# EasyEDA Pro project ProDoc_1.智能温室大棚.epro

# Board PCB1
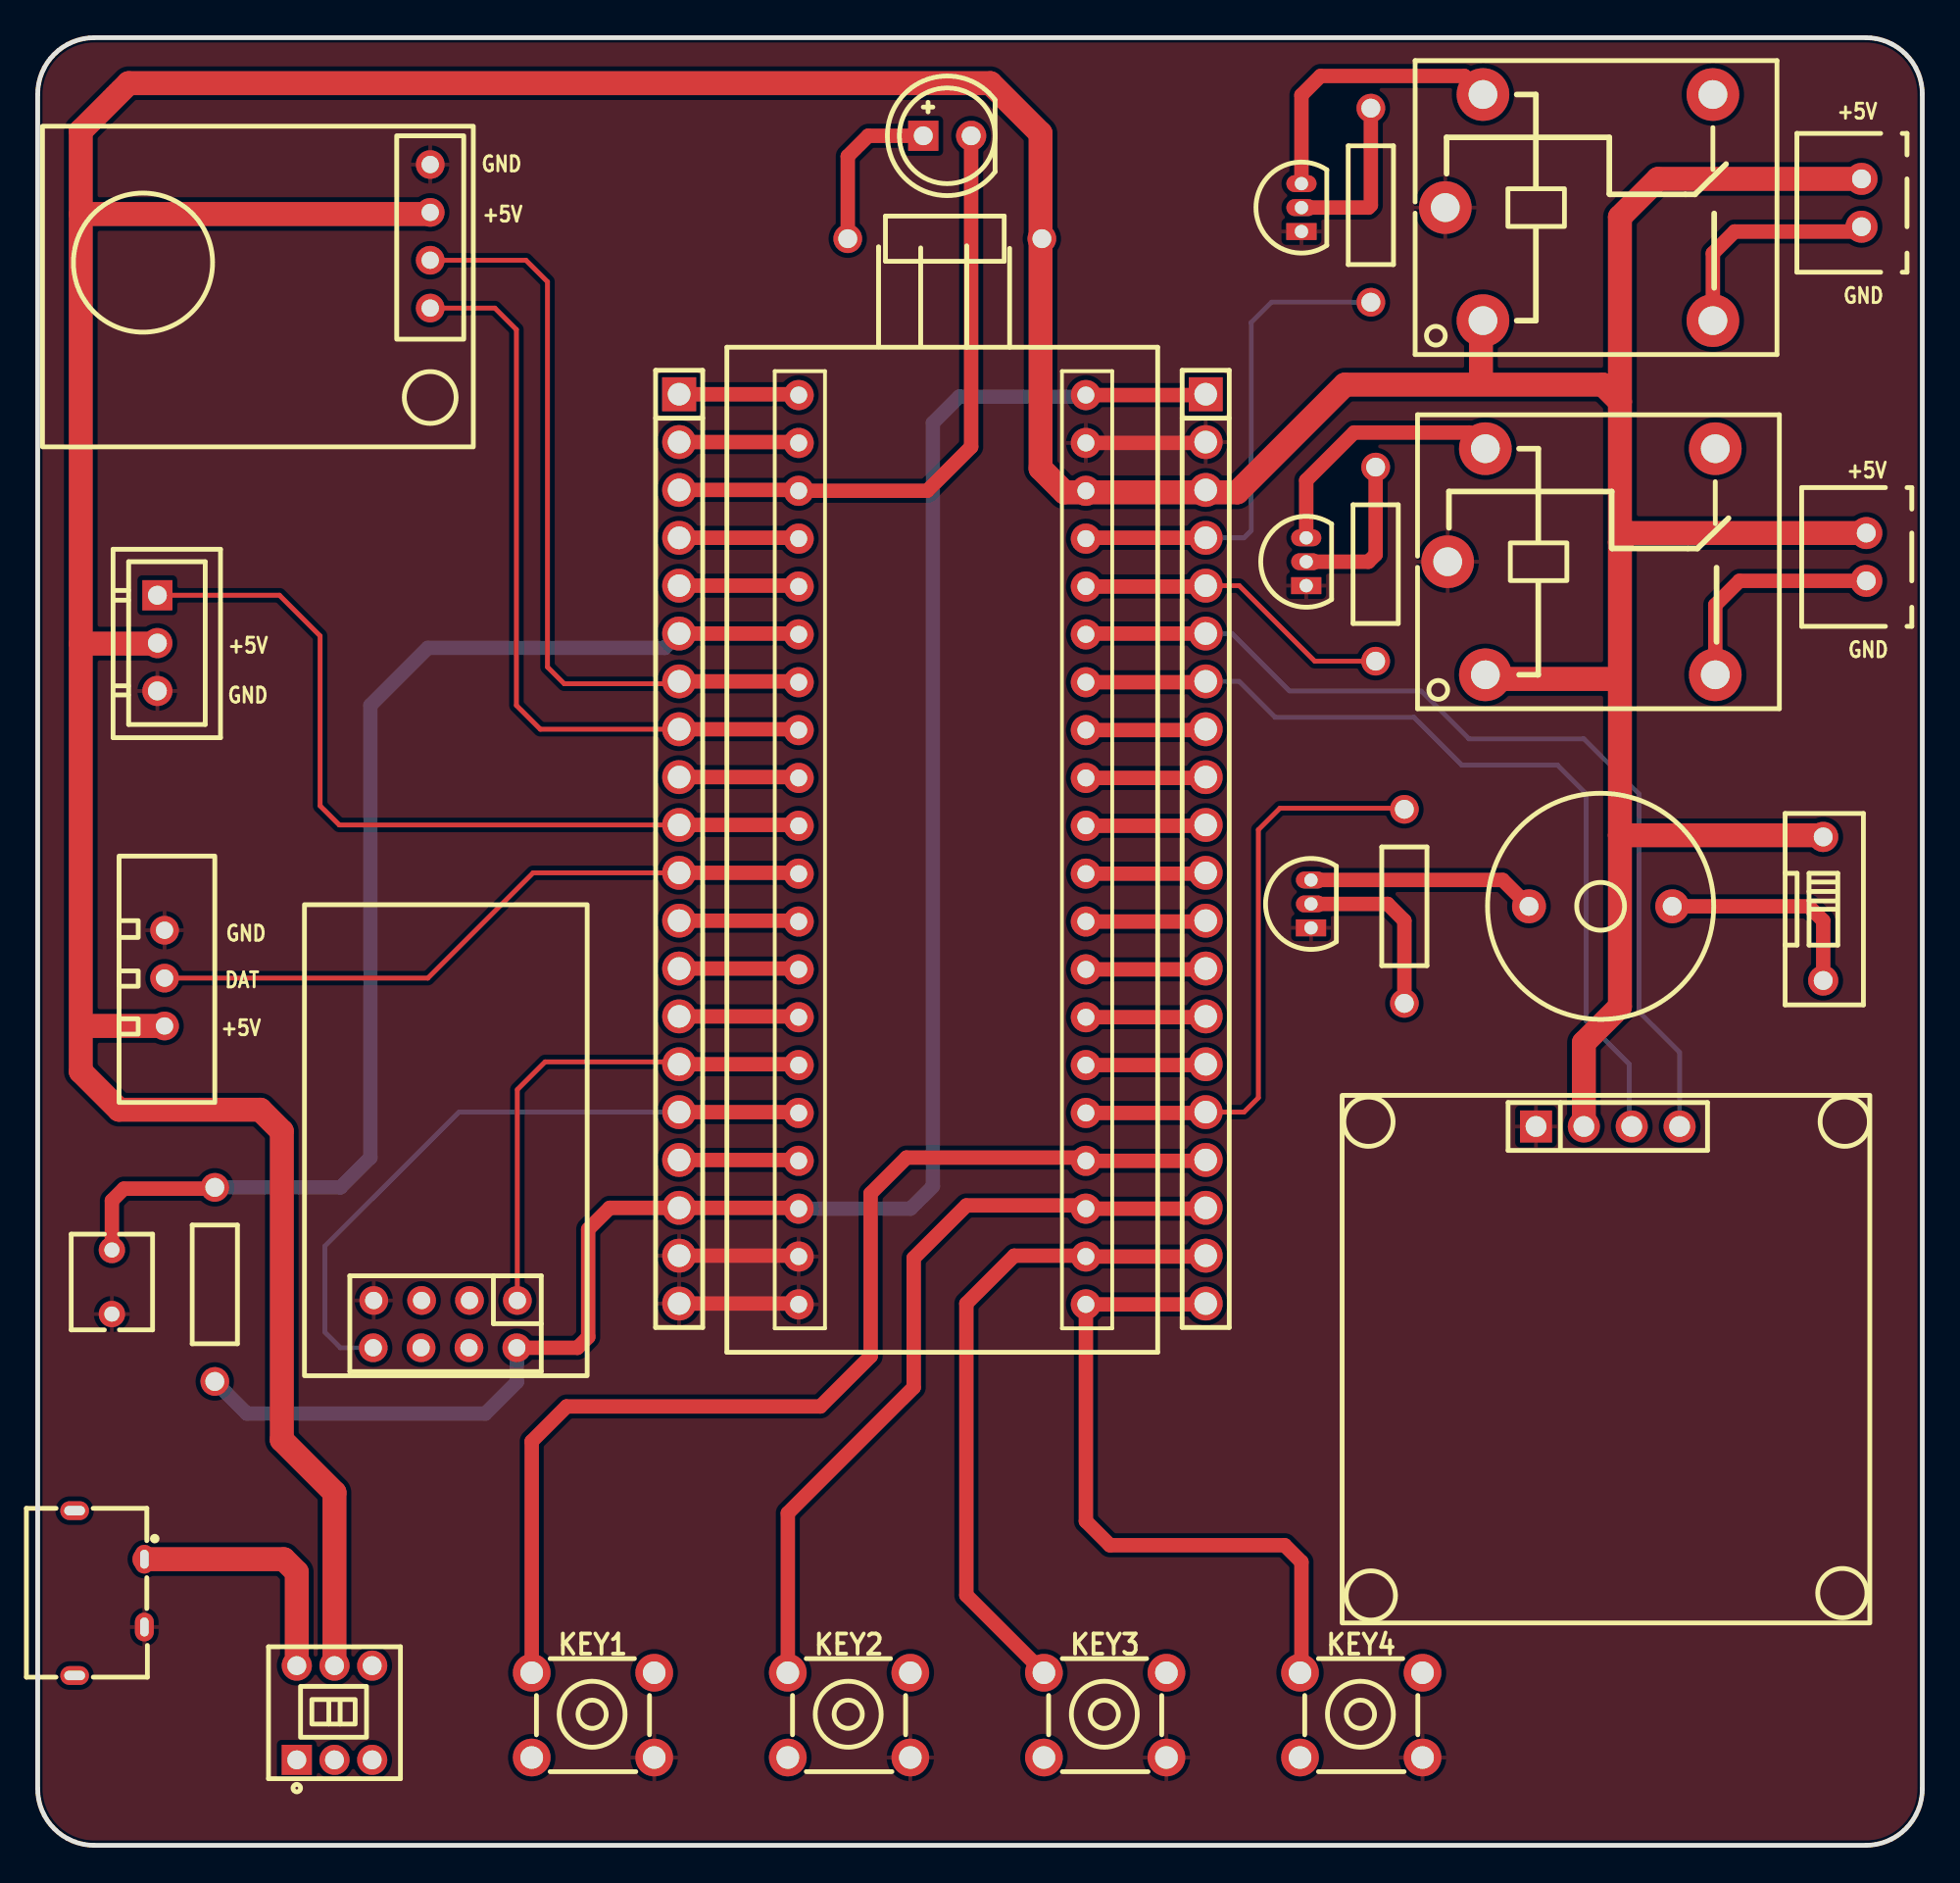
[diagram p0: board, top side]
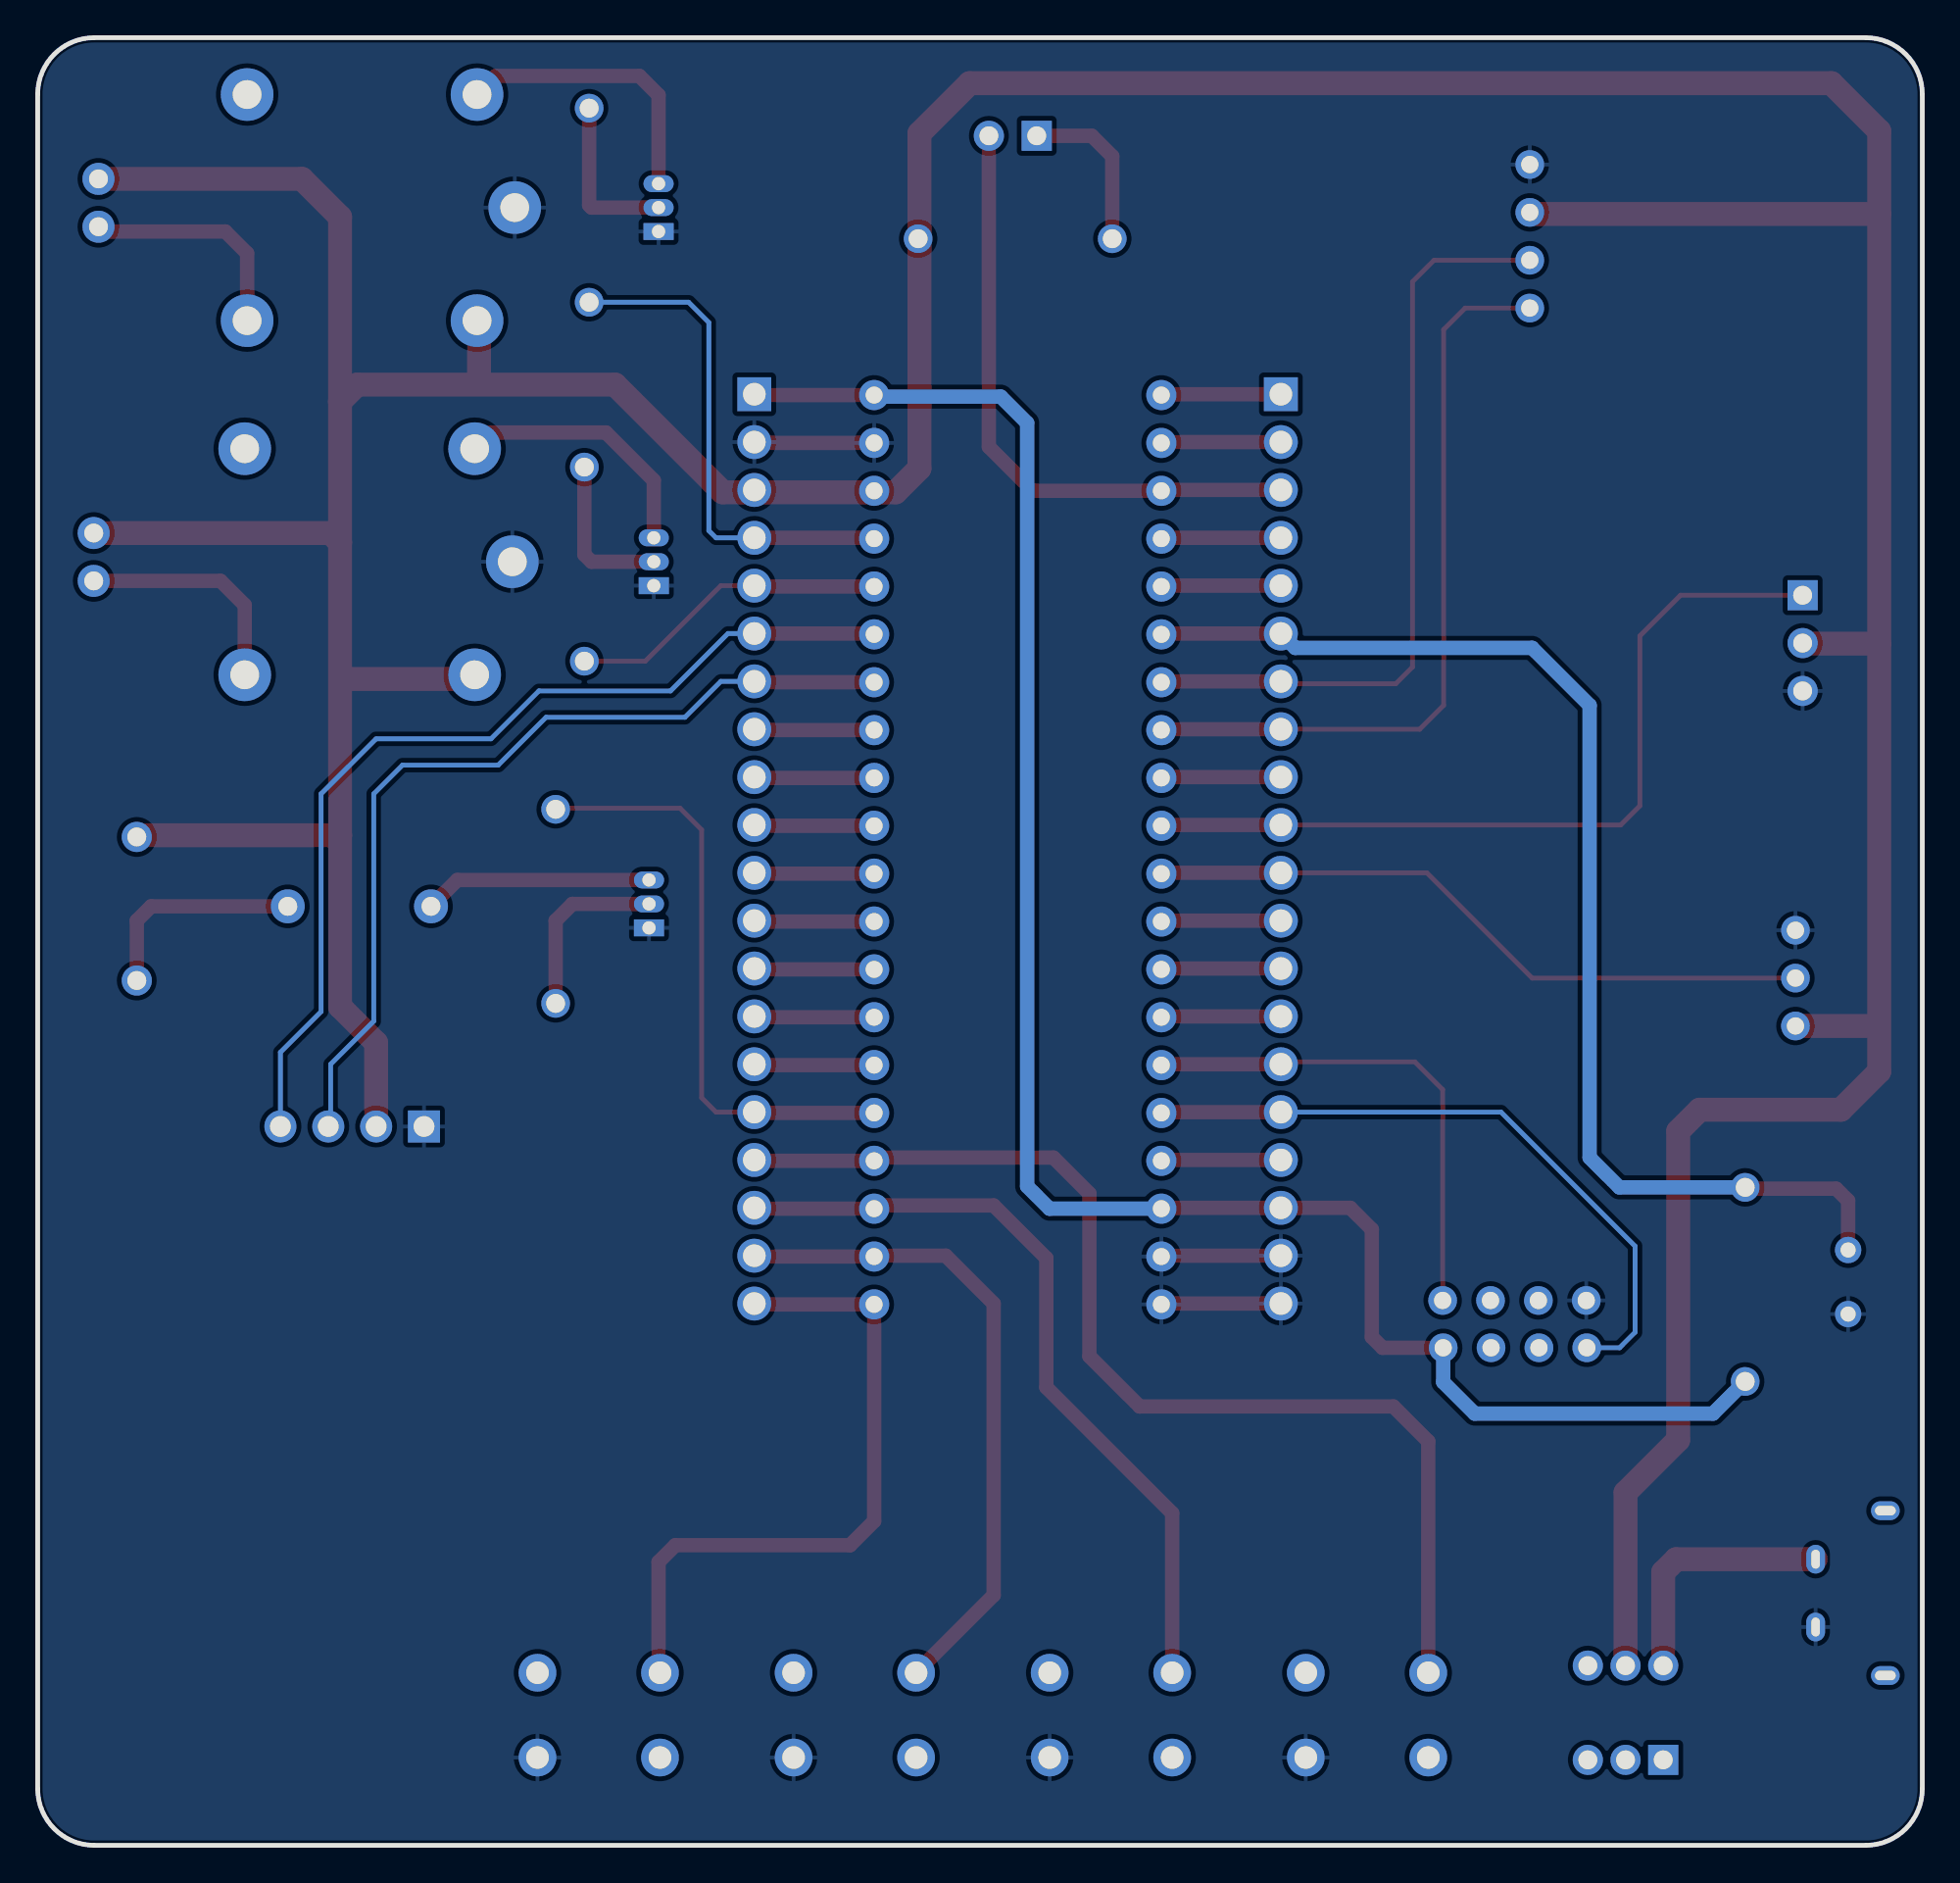
[diagram p1: board, bottom side, seen from below]

Outline 100 x 95.94 mm; copper layers: Top Layer, Bottom Layer. Coordinates in mm from the lower left corner of the outline.
Outline path: 0,92.94 0,3 arc(0.88,0.88) 3,0 97,0 arc(99.12,0.88) 100,3 100,92.94 arc(99.12,95.06) 97,95.94 3,95.94 arc(0.88,95.06) 0,92.94
Stack: Top Layer 0.035mm / Dielectric1 1.51mm FR4 er 4.5 / Bottom Layer 0.035mm

## Design rules (mm)
template: JLCPCB Capability(Two Layers Board)
spacing copperThickness1oz (default): track to track 0.102, other pairs 0.152 to 0.3
spacing copperThickness2oz: track to track 0.203, other pairs 0.152 to 0.3
track width copperThickness1oz (default): min 0.127, default 0.254, max 2.54
track width copperThickness2oz: min 0.203, default 0.254, max 2.54
differential pair differentialPair (default): width min 0.127, default 0.254, max 2.54; gap min 0.152, default 0.152
via viaSize (default): diameter min 0.5, default 0.61, max 10; hole min 0.3, default 0.305, max 6.3

## Placement (name value [footprint] x y rotation side)
BUZZER2  2.3kHz  [BUZ-TH_BD12.0-P7.60-D0.6-FD]  82.93 49.83 180 top
CN1  B2B-XH-A(LF)(SN)  [CONN-TH_B2B-XH-A-LF-SN]  96.77 87.17 90 top
CN2  B2B-XH-A(LF)(SN)  [CONN-TH_B2B-XH-A-LF-SN]  97.03 68.38 90 top
H2  2.54-1*4P母  [HDR-TH_4P-P2.54-V-F]  83.31 38.15 0 top
H3  -  [HDR-TH_20P-P2.54-V-M-1]  61.98 52.88 270 top
H4  -  [HDR-TH_20P-P2.54-V-M-1]  34.04 52.88 270 top
KEY1  按键1  [KEY-TH_4P-L6.0-W6.0-P4.50-LS7.5]  29.46 6.91 0 top
KEY2  按键5  [KEY-TH_4P-L6.0-W6.0-P4.50-LS7.5]  43.05 6.91 0 top
KEY3  按键2  [KEY-TH_4P-L6.0-W6.0-P4.50-LS7.5]  56.64 6.91 0 top
KEY4  按键4  [KEY-TH_4P-L6.0-W6.0-P4.50-LS7.5]  70.23 6.91 0 top
LED1  -  [LED-TH_5mm]  48.26 90.73 0 top
Q12  -  [S8050_TO_92]  67.06 86.92 90 top
Q13  -  [S8050_TO_92]  67.31 68.12 90 top
Q15  -  [S8050_TO_92]  67.56 49.96 90 top
R101  1kΩ  [Res_1/4W]  9.4 29.77 90 top
R111  1kΩ  [Res_1/4W]  70.74 87.05 270 top
R112  1kΩ  [Res_1/4W]  70.99 68 270 top
R114  1kΩ  [Res_1/4W]  72.52 49.83 270 top
R115  120Ω  [Res_1/4W]  48.13 85.27 180 top
RLY3  SRD-05VDC-SL-C  [RELAY-TH_SRD-XXVDC-XL-C]  81.79 86.92 0 top
RLY4  SRD-05VDC-SL-C  [RELAY-TH_SRD-XXVDC-XL-C]  81.91 68.12 0 top
SW8  TK-6700-1  [SW-TH_TK-6700-1]  15.75 7.04 0 top
SW10  DSWB01LHGET  [SW-TH_DSWB01LHGET]  94.74 49.71 0 top
U1  -  [温湿度]  6.73 46.02 270 top
U17  光敏电阻-5MM  [RES-TH_L4.9-W4.3-P3.4]  3.94 29.9 90 top
U44  -  [STM32最小系统板]  49.01 59.35 0 top
U56  -  [JW01]  20.83 85.39 0 top
U57  -  [水位-土壤]  6.86 63.55 0 top
U58  -  [WiFi封装]  21.59 34.21 0 top
USB2  KH-TYPE-C-2P  [USB-SMD_KH-TYPE-C-2P]  3.81 13.39 270 top

## Footprints (pads in the part's own frame, mm; a bottom-side part is the same pattern mirrored in y, then rotated)
BUZ-TH_BD12.0-P7.60-D0.6-FD
  round 1.8 hole 1: 1(-3.8,0) 2(3.8,0)
CONN-TH_B2B-XH-A-LF-SN
  round 1.7 hole 1: 1(1.27,0) 2(-1.27,0)
HDR-TH_4P-P2.54-V-F
  rect 1.7x1.7 hole 1.1: 1(-3.81,0)
  round 1.7 hole 1.1: 2(-1.27,0) 3(1.27,0) 4(3.81,0)
HDR-TH_20P-P2.54-V-M-1
  rect 1.8x1.8 hole 1.2: 1(-24.13,0)
  round 1.8 hole 1.2: 2(-21.59,0) 3(-19.05,0) 4(-16.51,0) 5(-13.97,0) 6(-11.43,0) 7(-8.89,0) 8(-6.35,0) 9(-3.81,0) 10(-1.27,0) 11(1.27,0) 12(3.81,0) 13(6.35,0) 14(8.89,0) 15(11.43,0) 16(13.97,0) 17(16.51,0) 18(19.05,0) 19(21.59,0) 20(24.13,0)
JW01
  round 1.524 hole 0.914: 1(0,3.81) 2(0,1.27) 3(0,-1.27) 4(0,-3.81)
KEY-TH_4P-L6.0-W6.0-P4.50-LS7.5
  round 2 hole 1.2: 1(-3.25,-2.25) 2(3.25,-2.25) 3(3.25,2.25) 4(-3.25,2.25)
LED-TH_5mm
  rect 1.6x1.6 hole 1: 1(-1.27,0)
  round 1.6 hole 1: 2(1.27,0)
RELAY-TH_SRD-XXVDC-XL-C
  round 2.794 hole 1.524: 1(-5.1,-6) 2(7.1,-6) 3(7.1,6) 4(-5.1,6) 5(-7.1,0)
RES-TH_L4.9-W4.3-P3.4
  round 1.4 hole 0.8: 1(-1.7,0) 2(1.7,0)
Res_1/4W
  round 1.524 hole 1: 1(-5.15,0) 2(5.15,0)
S8050_TO_92
  rect 0.899x1.6 hole 0.701: 1(-1.27,0)
  oval 0.899x1.6 hole 0.701: 2(0,0) 3(1.27,0)
STM32最小系统板
  round 1.6 hole 0.9: 1(-8.634,17.614) 2(-8.634,15.074) 3(-8.634,12.534) 4(-8.634,9.994) 5(-8.634,7.454) 6(-8.634,4.914) 7(-8.634,2.374) 8(-8.634,-0.166) 9(-8.634,-2.706) 10(-8.634,-5.246) 11(-8.634,-7.786) 12(-8.634,-10.326) 13(-8.634,-12.866) 14(-8.634,-15.406) 15(-8.634,-17.946) 16(-8.634,-20.486) 17(-8.634,-23.026) 18(-8.634,-25.566) 19(-8.634,-28.106) 20(-8.634,-30.646) 21(6.606,17.614) 22(6.606,15.074) 23(6.606,12.534) 24(6.606,9.994) 25(6.606,7.454) 26(6.606,4.914) 27(6.606,2.374) 28(6.606,-0.166) 29(6.606,-2.706) 30(6.606,-5.246) 31(6.606,-7.786) 32(6.606,-10.326) 33(6.606,-12.866) 34(6.606,-15.406) 35(6.606,-17.946) 36(6.606,-20.486) 37(6.606,-23.026) 38(6.606,-25.566) 39(6.606,-28.106) 40(6.606,-30.646)
SW-TH_DSWB01LHGET
  round 1.6 hole 1: 1(0,3.81) 2(0,-3.81)
SW-TH_TK-6700-1
  rect 1.6x1.6 hole 1: 1(-2,-2.5)
  round 1.6 hole 1: 2(0,-2.5) 3(2,-2.5) 4(-2,2.5) 5(0,2.5) 6(2,2.5)
USB-SMD_KH-TYPE-C-2P
  oval 1.524x1 hole 1x0.45: 1(-1.8,1.85) 2(1.8,1.85)
  oval 1x1.524 hole 0.5x1.1: 3(4.375,-1.85) 4(-4.375,-1.85)
WiFi封装
  round 1.524 hole 0.914: 1(3.861,-5.297) 2(3.833,-7.808) 3(1.321,-5.297) 4(1.293,-7.808) 5(-1.219,-5.297) 6(-1.247,-7.808) 7(-3.759,-5.297) 8(-3.787,-7.808)
水位-土壤
  rect 1.6x1.6 hole 1: 1(-0.508,2.794)
  round 1.6 hole 1: 2(-0.508,0.254) 3(-0.508,-2.286)
温湿度
  round 1.524 hole 0.914: 1(-2.54,0) 2(0,0) 3(2.54,0)

## Nets
3V3: H3.1 H4.18 R101.1 U44.18 U44.21 U58.2
+5V: CN1.1 CN2.1 H2.2 H3.3 R115.1 RLY3.1 RLY4.1 SW8.5 SW10.1 U1.3 U44.23 U56.2 U57.2
GND: H2.1 H3.2 H4.19 H4.20 KEY1.2 KEY2.2 KEY3.2 KEY4.2 Q12.1 Q13.1 Q15.1 RLY3.5 RLY4.5 U1.1 U17.1 U44.19 U44.20 U44.22 U56.1 U57.3 U58.7 USB2.2
PA1: H4.6 R101.2 U17.2 U44.6
PA5: H4.10 U44.10 U57.1
PA6: H4.11 U1.2 U44.11
PA8: H3.16 R114.1 U44.36
PB6: H2.3 H3.7 U44.27
PB7: H2.4 H3.6 U44.26
PB8: H3.5 R112.2 U44.25
PB9: H3.4 R111.2 U44.24
PB12: H3.20 KEY4.4 U44.40
PB13: H3.19 KEY3.4 U44.39
PB14: H3.18 KEY2.4 U44.38
PB15: H3.17 KEY1.4 U44.37
PC14: H4.3 LED1.2 U44.3
U1_RX: H3.14 U44.34
U1_TX: H3.15 U44.35
U2_RX: H4.8 U44.8 U56.4
U2_TX: H4.7 U44.7 U56.3
U3_RX: H4.16 U44.16 U58.8
U3_TX: H4.15 U44.15 U58.1
VUSB: SW8.4 USB2.1
$1N498: H3.8 U44.28
$1N499: H3.9 U44.29
$1N500: H3.10 U44.30
$1N501: H3.11 U44.31
$1N502: H3.12 U44.32
$1N503: H3.13 U44.33
$1N517: H4.1 U44.1
$1N518: H4.2 U44.2
$1N520: H4.4 U44.4
$1N521: H4.5 U44.5
$1N527: H4.9 U44.9
$1N530: H4.12 U44.12
$1N531: H4.13 U44.13
$1N532: H4.14 U44.14
$1N537: H4.17 U44.17
$1N1179: Q12.3 RLY3.4
$1N1180: Q12.2 R111.1
$1N1183: CN1.2 RLY3.2
$1N1390: Q13.3 RLY4.4
$1N1391: Q13.2 R112.1
$1N1394: CN2.2 RLY4.2
$1N1787: Q15.2 R114.2
$1N1790: BUZZER2.2 Q15.3
$1N1791: BUZZER2.1 SW10.2
$1N3015: LED1.1 R115.2

Pads without a net: KEY1 1 3; KEY2 1 3; KEY3 1 3; KEY4 1 3; RLY3 3; RLY4 3; SW8 1 2 3 6; U58 3 4 5 6; USB2 3 4

## Routing (per net, layer and track width the routed paths; a pad name or vN(x,y) marks a point on that pad's centre or on a via; arc(x,y) is an arc through that point)
3V3: length 103.9
  Top Layer w0.762: H3.1 61.93,76.97 55.62,76.97 ; U58.2 28.64,26.41 29.21,26.97 29.21,32.69 30.35,33.83 H4.18 40.33,33.83 40.38,33.79
  Bottom Layer w0.762: R101.1 11.11,22.91 23.75,22.91 25.42,24.58 U58.2 ; 40.38,33.79 46.31,33.79 47.5,34.98 47.5,75.49 48.9,76.89 55.54,76.89 55.62,76.97
+5V: length 320
  Top Layer w1.27: SW10.1 94.65,53.61 83.96,53.61 ; U57.2 6.32,63.78 2.29,63.78 ; 76.69,80.92 76.58,80.81 76.58,77.9 ; 55.54,71.81 54.48,71.81 53.21,73.08 53.21,90.86 50.55,93.52 4.83,93.52 2.29,90.98 2.29,86.58 ; 55.54,71.81 61.85,71.81 ; 55.54,71.81 55.62,71.89 ; 83.57,61.9 77.04,61.9 RLY4.1 ; 2.29,63.78 2.29,41.07 4.32,39.04 11.81,39.04 12.95,37.9 12.95,21.51 15.75,18.72 SW8.5 ; 2.29,63.78 2.29,86.58 ; 83.96,53.61 83.96,44.51 82.04,42.6 H2.2 ; 83.96,53.61 83.96,69.14 ; 61.85,71.81 H3.3 ; 61.85,71.81 63.65,71.81 69.36,77.52 83.06,77.52 83.96,76.62 ; 83.96,76.62 83.96,69.14 ; 83.96,76.62 83.96,86.42 85.98,88.44 CN1.1 ; 83.96,69.14 84.46,69.65 CN2.1 ; U56.2 20.74,86.58 2.29,86.58 ; 2.67,43.48 U1.3
GND: length 19.1
  Top Layer w0.762: U44.22 61.93,74.43 H3.2 ; 40.38,28.71 40.33,28.75 H4.20 ; 40.38,31.25 40.33,31.29 H4.19
PA1: length 65.6
  Top Layer w0.762: 40.38,64.27 40.33,64.31 H4.6 ; R101.2 9.33,34.85 4.57,34.85 3.94,34.21 3.94,31.6
  Bottom Layer w0.762: R101.2 16.07,34.92 17.65,36.5 17.65,60.5 20.7,63.55 33.27,63.55 H4.6
PA5: length 44.4
  Top Layer w0.254: U57.1 12.83,66.34 14.99,64.19 14.99,55.17 16,54.15 H4.10
  Top Layer w0.762: 40.38,54.11 40.33,54.15 H4.10
PA6: length 36
  Top Layer w0.254: U1.2 20.7,46.02 26.29,51.61 H4.11
  Top Layer w0.762: 40.38,51.57 40.33,51.61 H4.11
PA8: length 32
  Top Layer w0.254: R114.1 72.46,55.04 65.91,55.04 64.77,53.9 64.77,39.67 64.01,38.91 H3.16
  Top Layer w0.762: U44.36 61.93,38.87 H3.16
PB6: length 47.7
  Top Layer w0.762: U44.27 61.93,61.73 H3.7
  Bottom Layer w0.254: H3.7 63.75,61.77 65.66,59.87 73.03,59.87 75.56,57.33 80.65,57.33 82.17,55.8 82.17,43.74 84.46,41.45 84.46,38.28 H2.3
PB7: length 51.4
  Top Layer w0.762: H3.6 55.66,64.31 U44.26
  Bottom Layer w0.254: H2.4 87.12,42.09 84.96,44.25 84.96,55.8 82.04,58.72 75.95,58.72 73.41,61.27 66.42,61.27 63.37,64.31 H3.6
PB8: length 17.1
  Top Layer w0.254: H3.5 63.75,66.85 67.76,62.85 R112.2
  Top Layer w0.762: U44.25 61.93,66.81 H3.5
PB9: length 26.8
  Top Layer w0.762: U44.24 55.66,69.39 H3.4
  Bottom Layer w0.254: R111.2 65.46,81.9 64.39,80.82 64.39,69.77 64.01,69.39 H3.4
PB12: length 36.1
  Top Layer w0.762: H3.20 61.93,28.71 U44.40 55.62,17.2 56.9,15.93 66.17,15.93 67.06,15.04 67.06,9.23 KEY4.4
PB13: length 35.1
  Top Layer w0.762: KEY3.4 49.28,13.28 49.28,28.75 51.82,31.29 55.57,31.29 U44.39 61.93,31.25 H3.19
PB14: length 41.5
  Top Layer w0.762: H3.18 61.93,33.79 U44.38 55.45,33.96 49.28,33.96 46.48,31.17 46.48,24.31 39.8,17.63 KEY2.4
PB15: length 59.4
  Top Layer w0.762: H3.17 61.93,36.33 55.62,36.33 55.45,36.5 46.1,36.5 44.2,34.59 44.2,25.96 41.53,23.29 28.07,23.29 26.21,21.44 KEY1.4
PC14: length 33
  Top Layer w0.762: H4.3 40.33,71.93 40.38,71.89 47.2,71.89 49.53,74.22 LED1.2
U1_RX: length 6.4
  Top Layer w0.762: H3.14 61.93,43.95 U44.34
U1_TX: length 6.4
  Top Layer w0.762: H3.15 61.93,41.41 U44.35
U2_RX: length 40.5
  Top Layer w0.254: H4.8 26.67,59.23 25.4,60.5 25.4,80.44 24.26,81.58 U56.4
  Top Layer w0.762: 40.38,59.19 40.33,59.23 H4.8
U2_TX: length 40.9
  Top Layer w0.254: H4.7 33.91,61.65 27.94,61.65 27.05,62.53 27.05,82.98 25.91,84.12 U56.3
  Top Layer w0.762: H4.7 40.33,61.77 40.38,61.73
U3_RX: length 35.6
  Top Layer w0.762: 40.38,38.87 40.33,38.91 H4.16
  Bottom Layer w0.254: H4.16 22.35,38.91 15.24,31.8 15.24,27.23 16.06,26.41 U58.8
U3_TX: length 27.2
  Top Layer w0.254: 34.41,41.45 34.28,41.58 26.92,41.58 25.45,40.11 U58.1
  Top Layer w0.762: 40.38,41.41 40.33,41.45 H4.15
VUSB: length 13.3
  Top Layer w1.27: SW8.4 13.75,14.5 13.06,15.19 USB2.1
$1N498: length 6.4
  Top Layer w0.762: H3.8 61.93,59.19 U44.28
$1N499: length 6.4
  Top Layer w0.762: H3.9 61.93,56.65 U44.29
$1N500: length 6.4
  Top Layer w0.762: 55.62,54.11 61.93,54.11 H3.10
$1N501: length 6.4
  Top Layer w0.762: H3.11 61.93,51.57 U44.31
$1N502: length 6.4
  Top Layer w0.762: H3.12 61.93,49.03 U44.32
$1N503: length 6.4
  Top Layer w0.762: U44.33 61.93,46.49 H3.13
$1N517: length 6.4
  Top Layer w0.762: H4.1 40.33,77.01 40.38,76.97
$1N518: length 6.4
  Top Layer w0.762: H4.2 40.33,74.47 40.38,74.43
$1N520: length 6.4
  Top Layer w0.762: H4.4 40.33,69.39 40.38,69.35
$1N521: length 6.4
  Top Layer w0.762: 40.38,66.81 40.33,66.85 H4.5
$1N527: length 6.4
  Top Layer w0.762: 40.38,56.65 40.33,56.69 H4.9
$1N530: length 6.4
  Top Layer w0.762: 40.38,49.03 40.33,49.07 H4.12
$1N531: length 6.4
  Top Layer w0.762: H4.13 40.33,46.53 40.38,46.49
$1N532: length 6.4
  Top Layer w0.762: 40.38,43.95 40.33,43.99 H4.14
$1N537: length 6.4
  Top Layer w0.762: 40.38,36.33 40.33,36.37 H4.17
$1N1179: length 15.2
  Top Layer w0.762: Q12.3 67.06,92.89 68.07,93.9 75.7,93.9 76.69,92.92
$1N1180: length 8.9
  Top Layer w0.762: R111.1 70.74,87.05 70.61,86.92 Q12.2
$1N1183: length 12
  Top Layer w0.762: RLY3.2 88.89,84.49 90.04,85.65 96.52,85.65 CN1.2
$1N1390: length 14
  Top Layer w0.762: Q13.3 67.31,72.44 69.85,74.98 75.96,74.98 RLY4.4
$1N1391: length 8.5
  Top Layer w0.762: R112.1 70.99,68.5 70.61,68.12 Q13.2
$1N1394: length 12.2
  Top Layer w0.762: CN2.2 90.3,67.11 89.02,65.82 RLY4.2
$1N1787: length 9.7
  Top Layer w0.762: Q15.2 71.63,49.96 72.52,49.07 R114.2
$1N1790: length 12.1
  Top Layer w0.762: BUZZER2.2 77.73,51.23 Q15.3
$1N1791: length 11.5
  Top Layer w0.762: BUZZER2.1 93.98,49.83 94.74,49.07 SW10.2
$1N3015: length 8.9
  Top Layer w0.762: 43.11,85.27 42.98,85.39 42.98,89.64 44.07,90.73 46.99,90.73

## Copper pours and planes (outline as drawn; the poured copper is in the pictures)
GND on Top Layer: -18.8,104.7 112.27,104.7 112.27,-7.57 -18.8,-7.57
GND on Bottom Layer: -10.29,104.57 107.19,104.57 107.19,-7.06 -10.29,-7.06

## Text on the board
Top Silkscreen Layer: +5V | DAT | GND
